# EasyEDA schematic SCH_RE2-YM2413-REV.0.5_2024-09-29.json

## Sheets
1 OPLL: TITLE: Sheet_1; REV: 1.0; Date: 2023-12-16; Sheet: 1/1; Drawn By: Denjhang; Company: Your Company
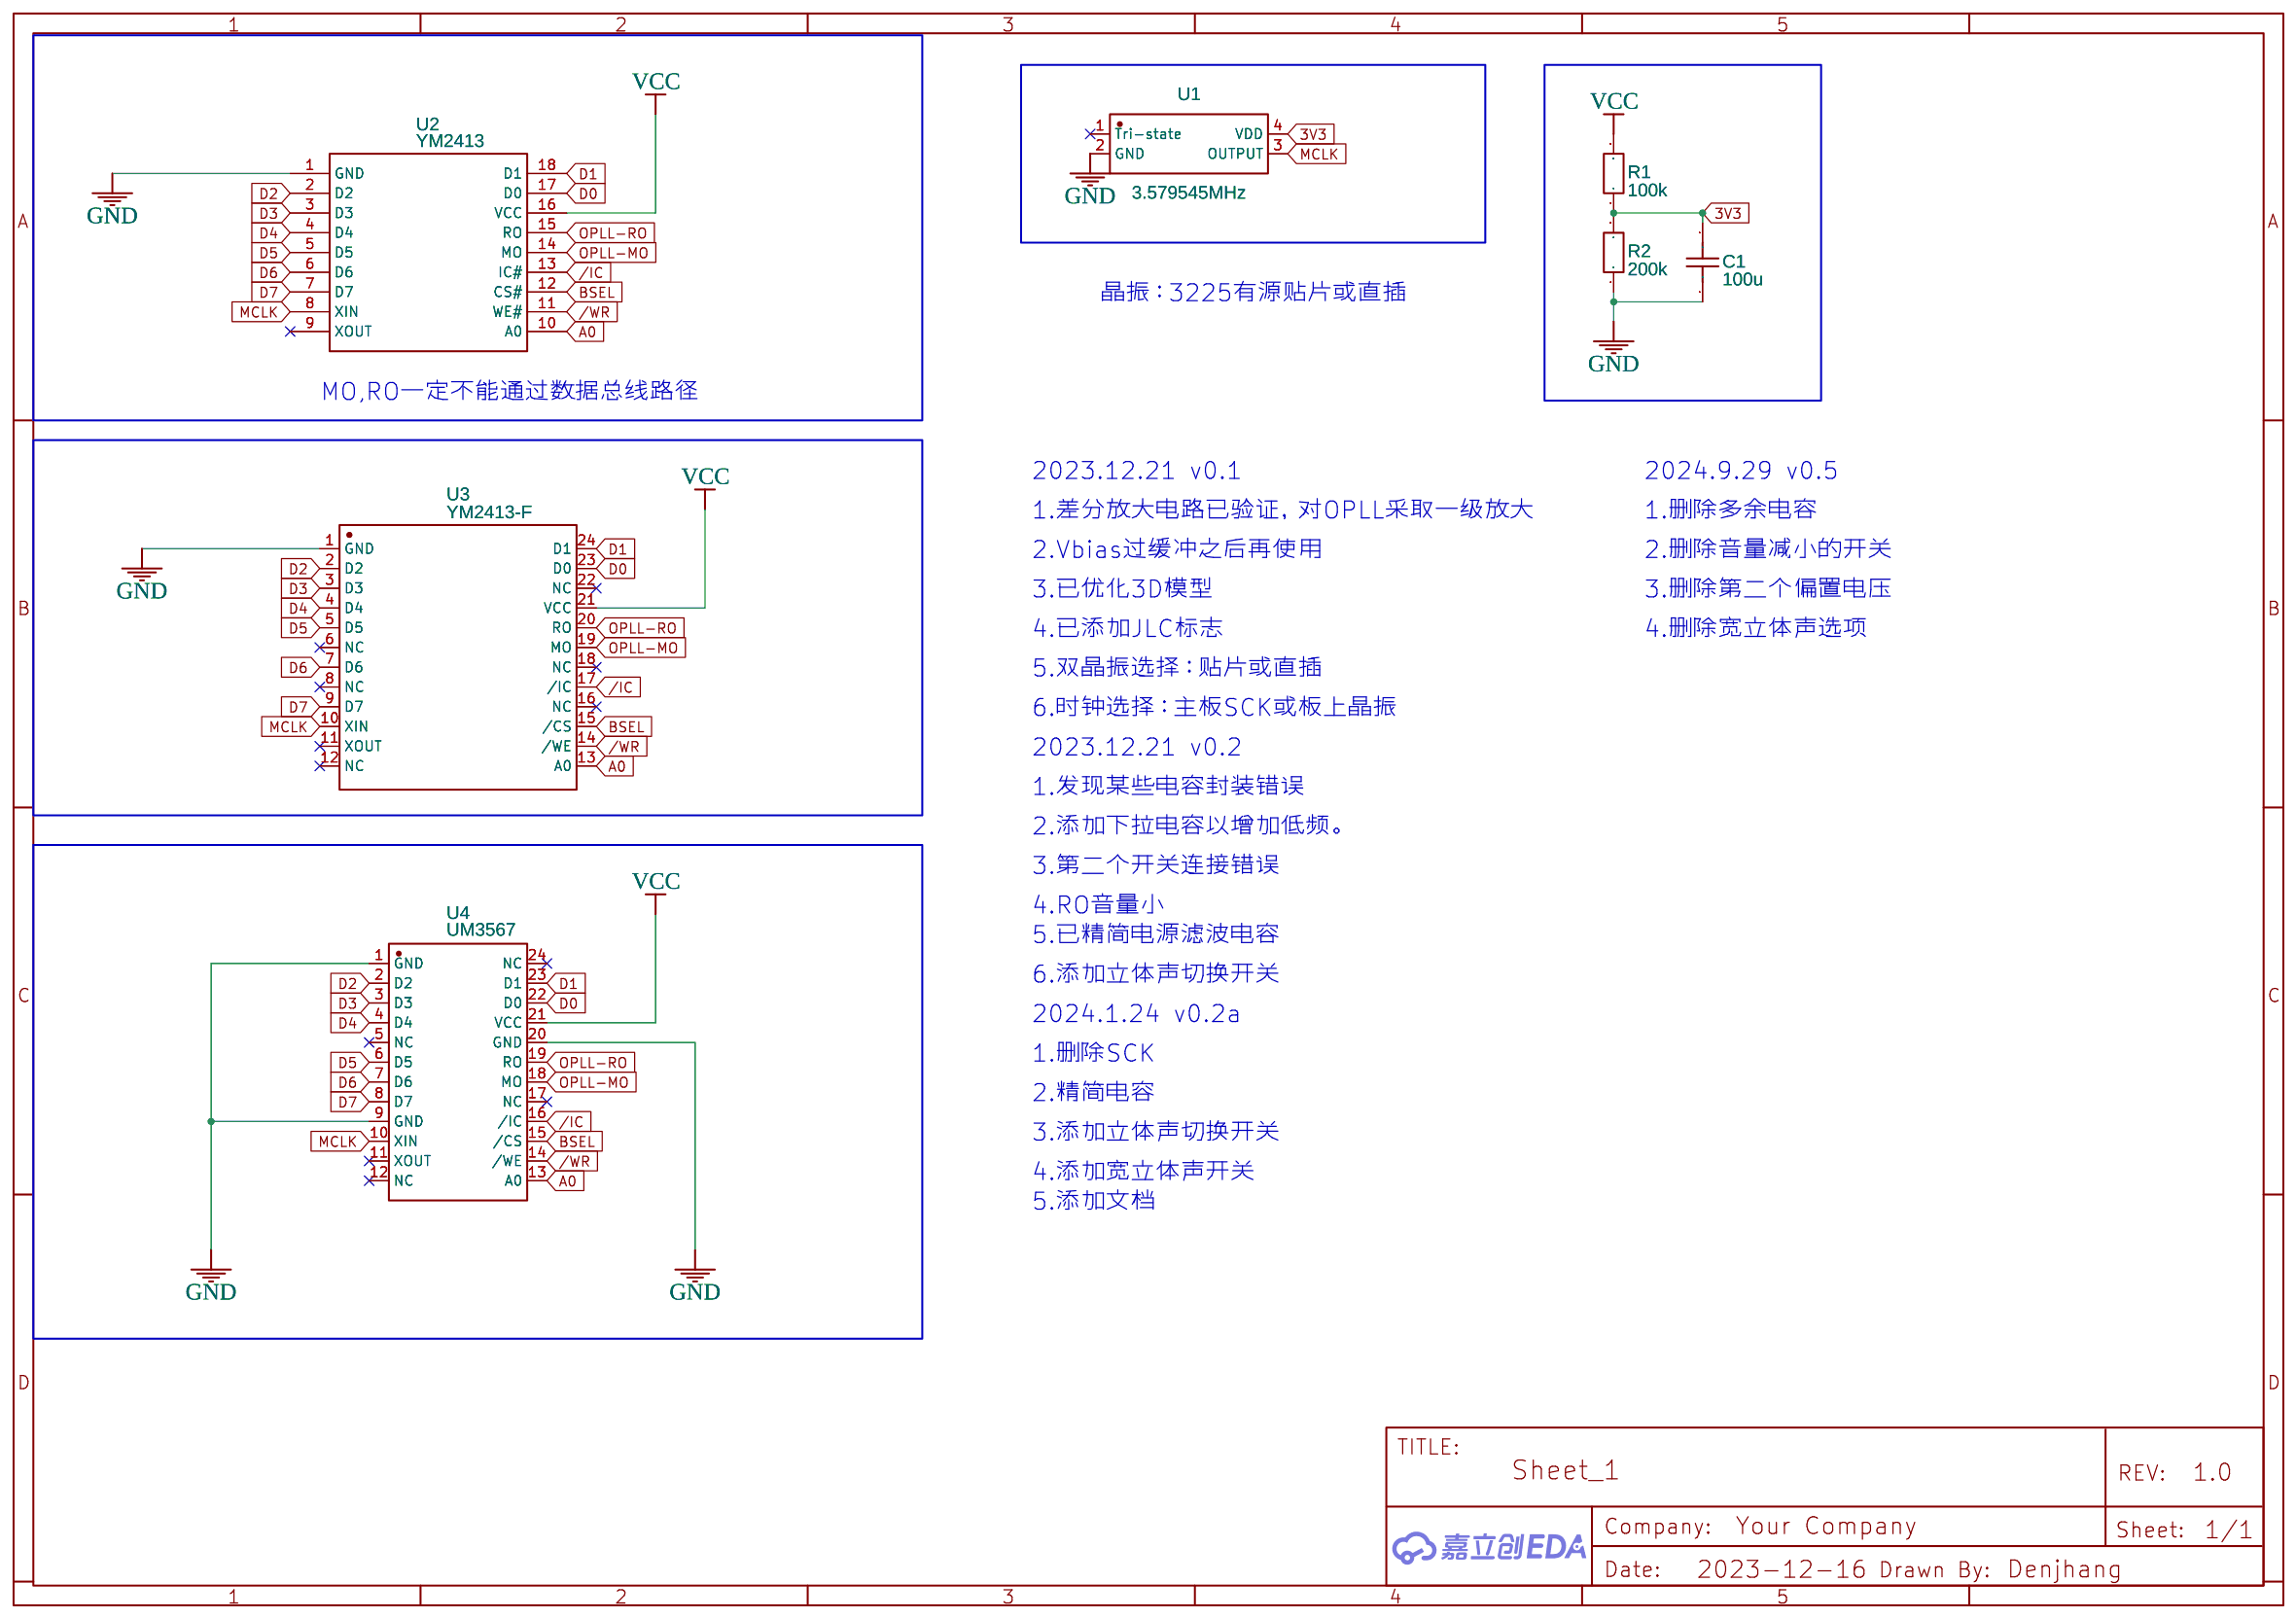
[diagram p0: OPLL]
2 BUS-PSU
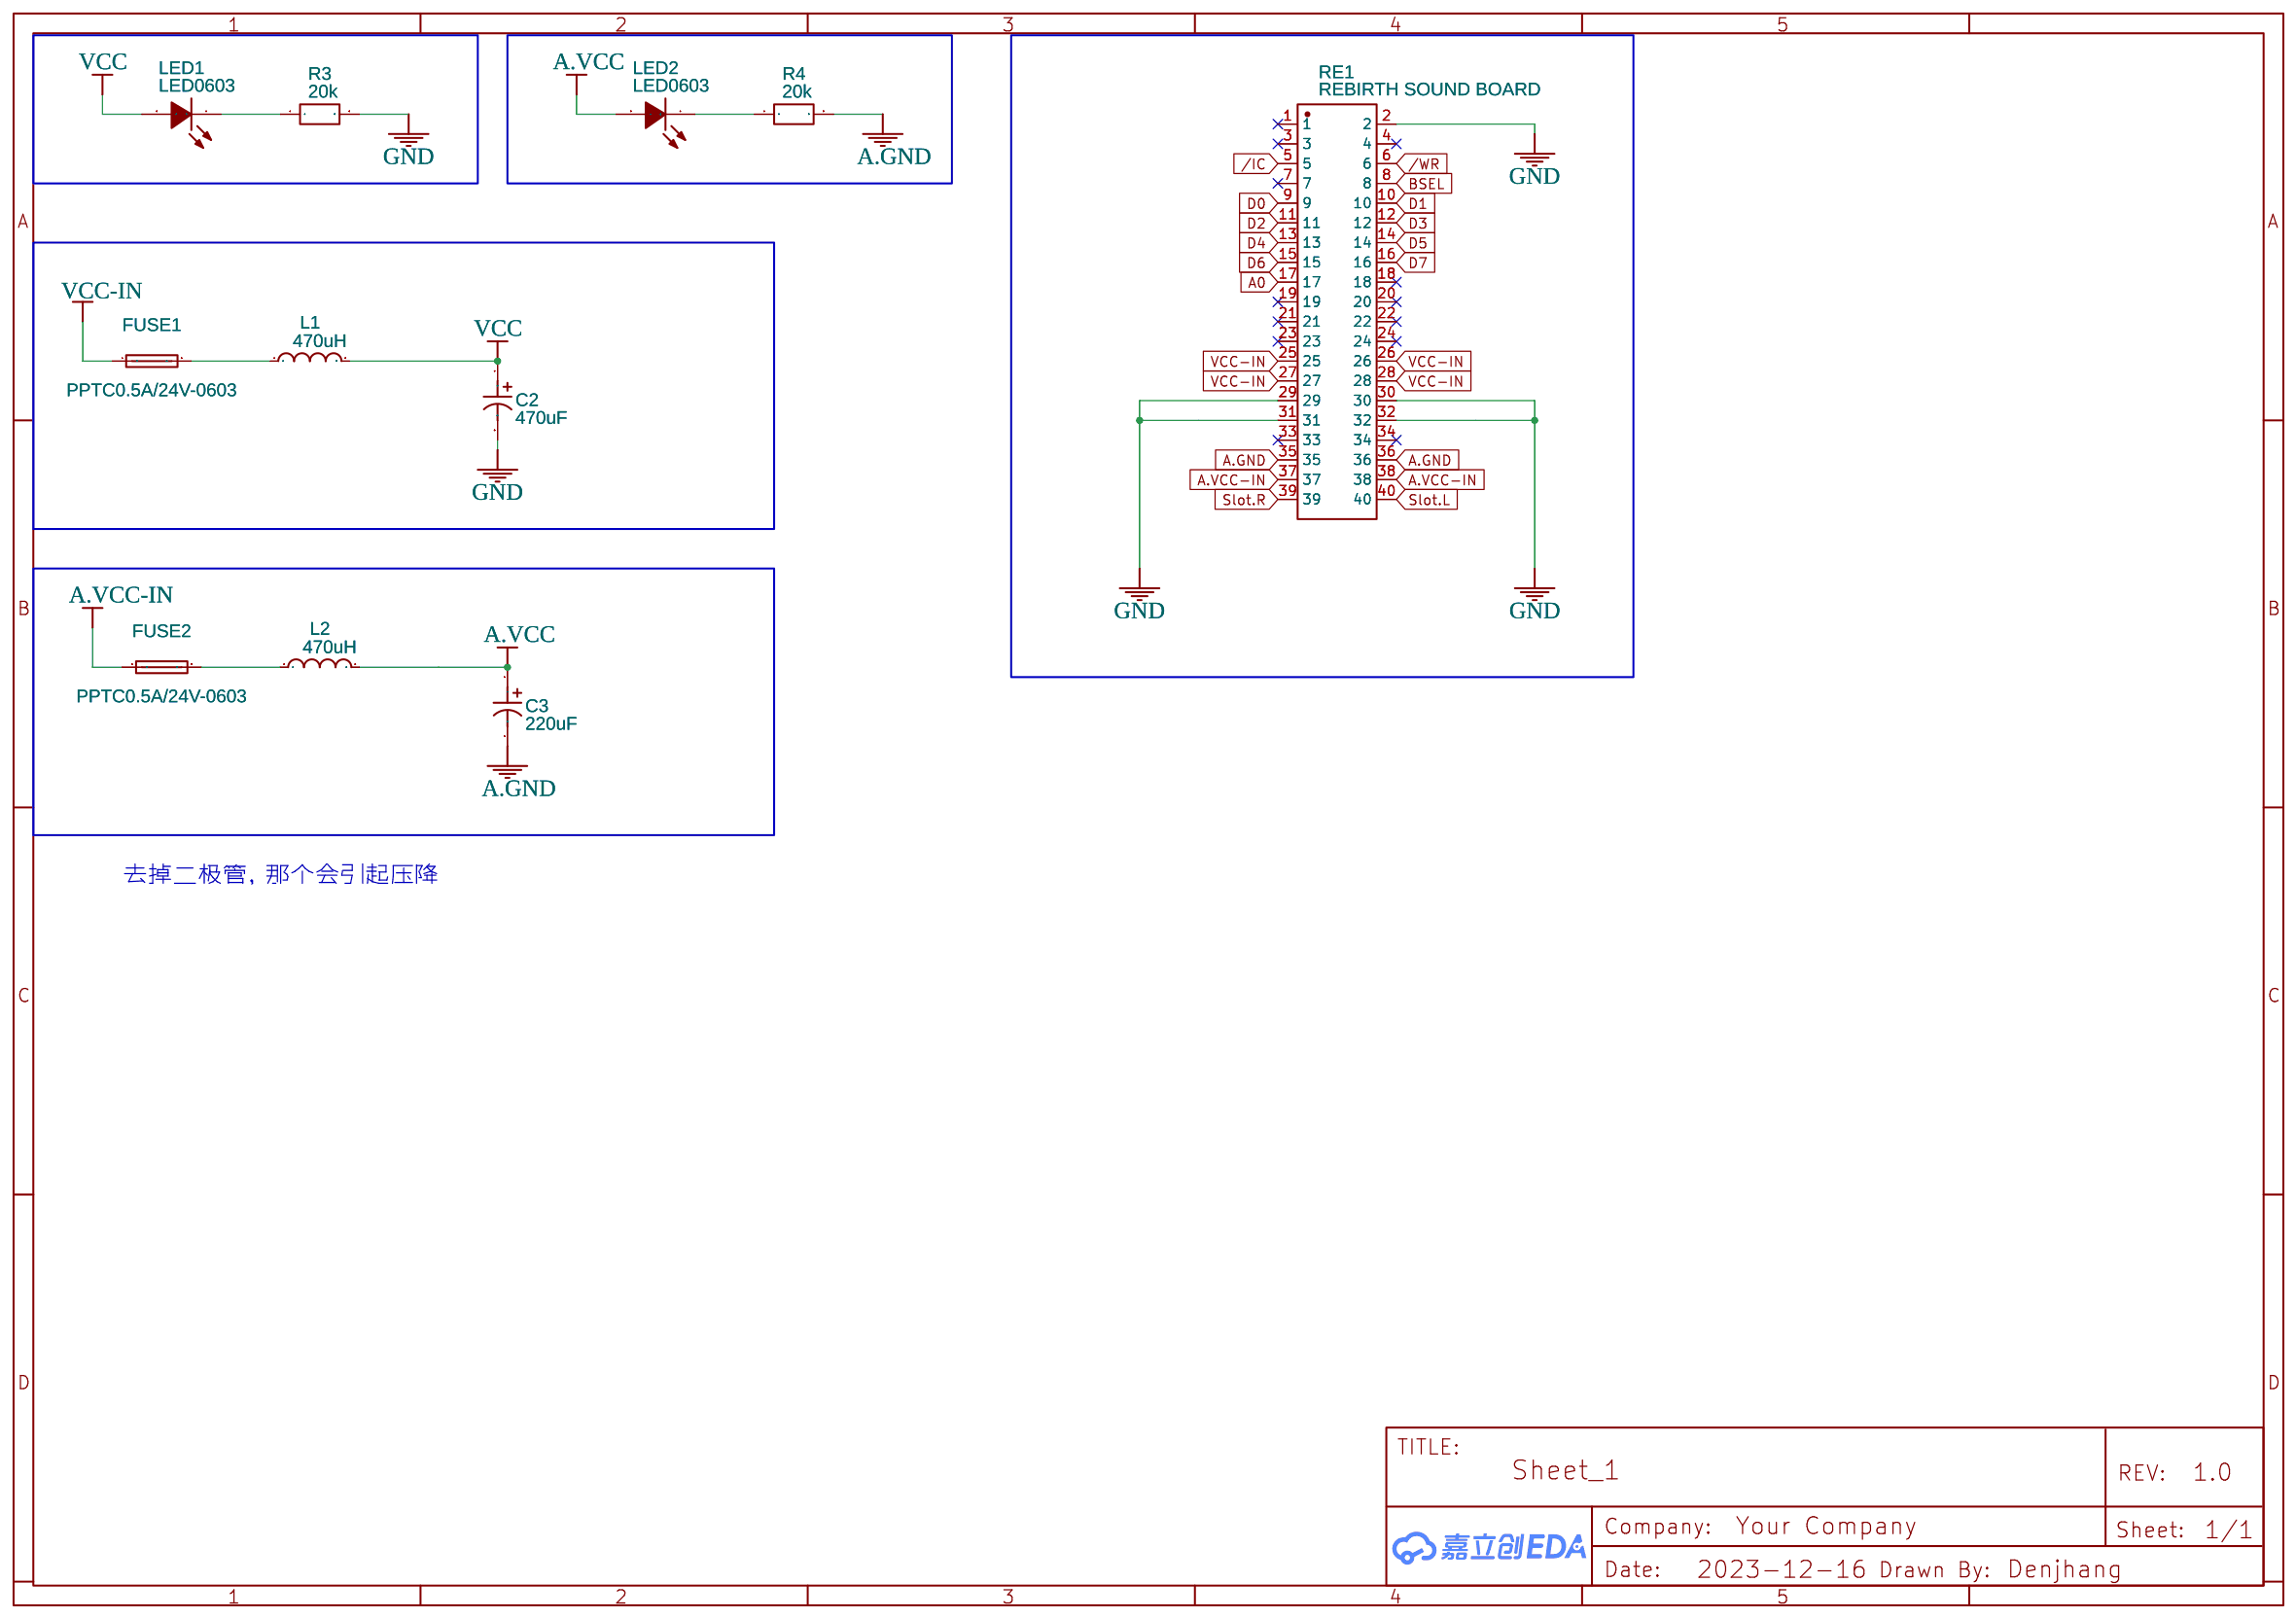
[diagram p1: BUS-PSU]
3 AMP1
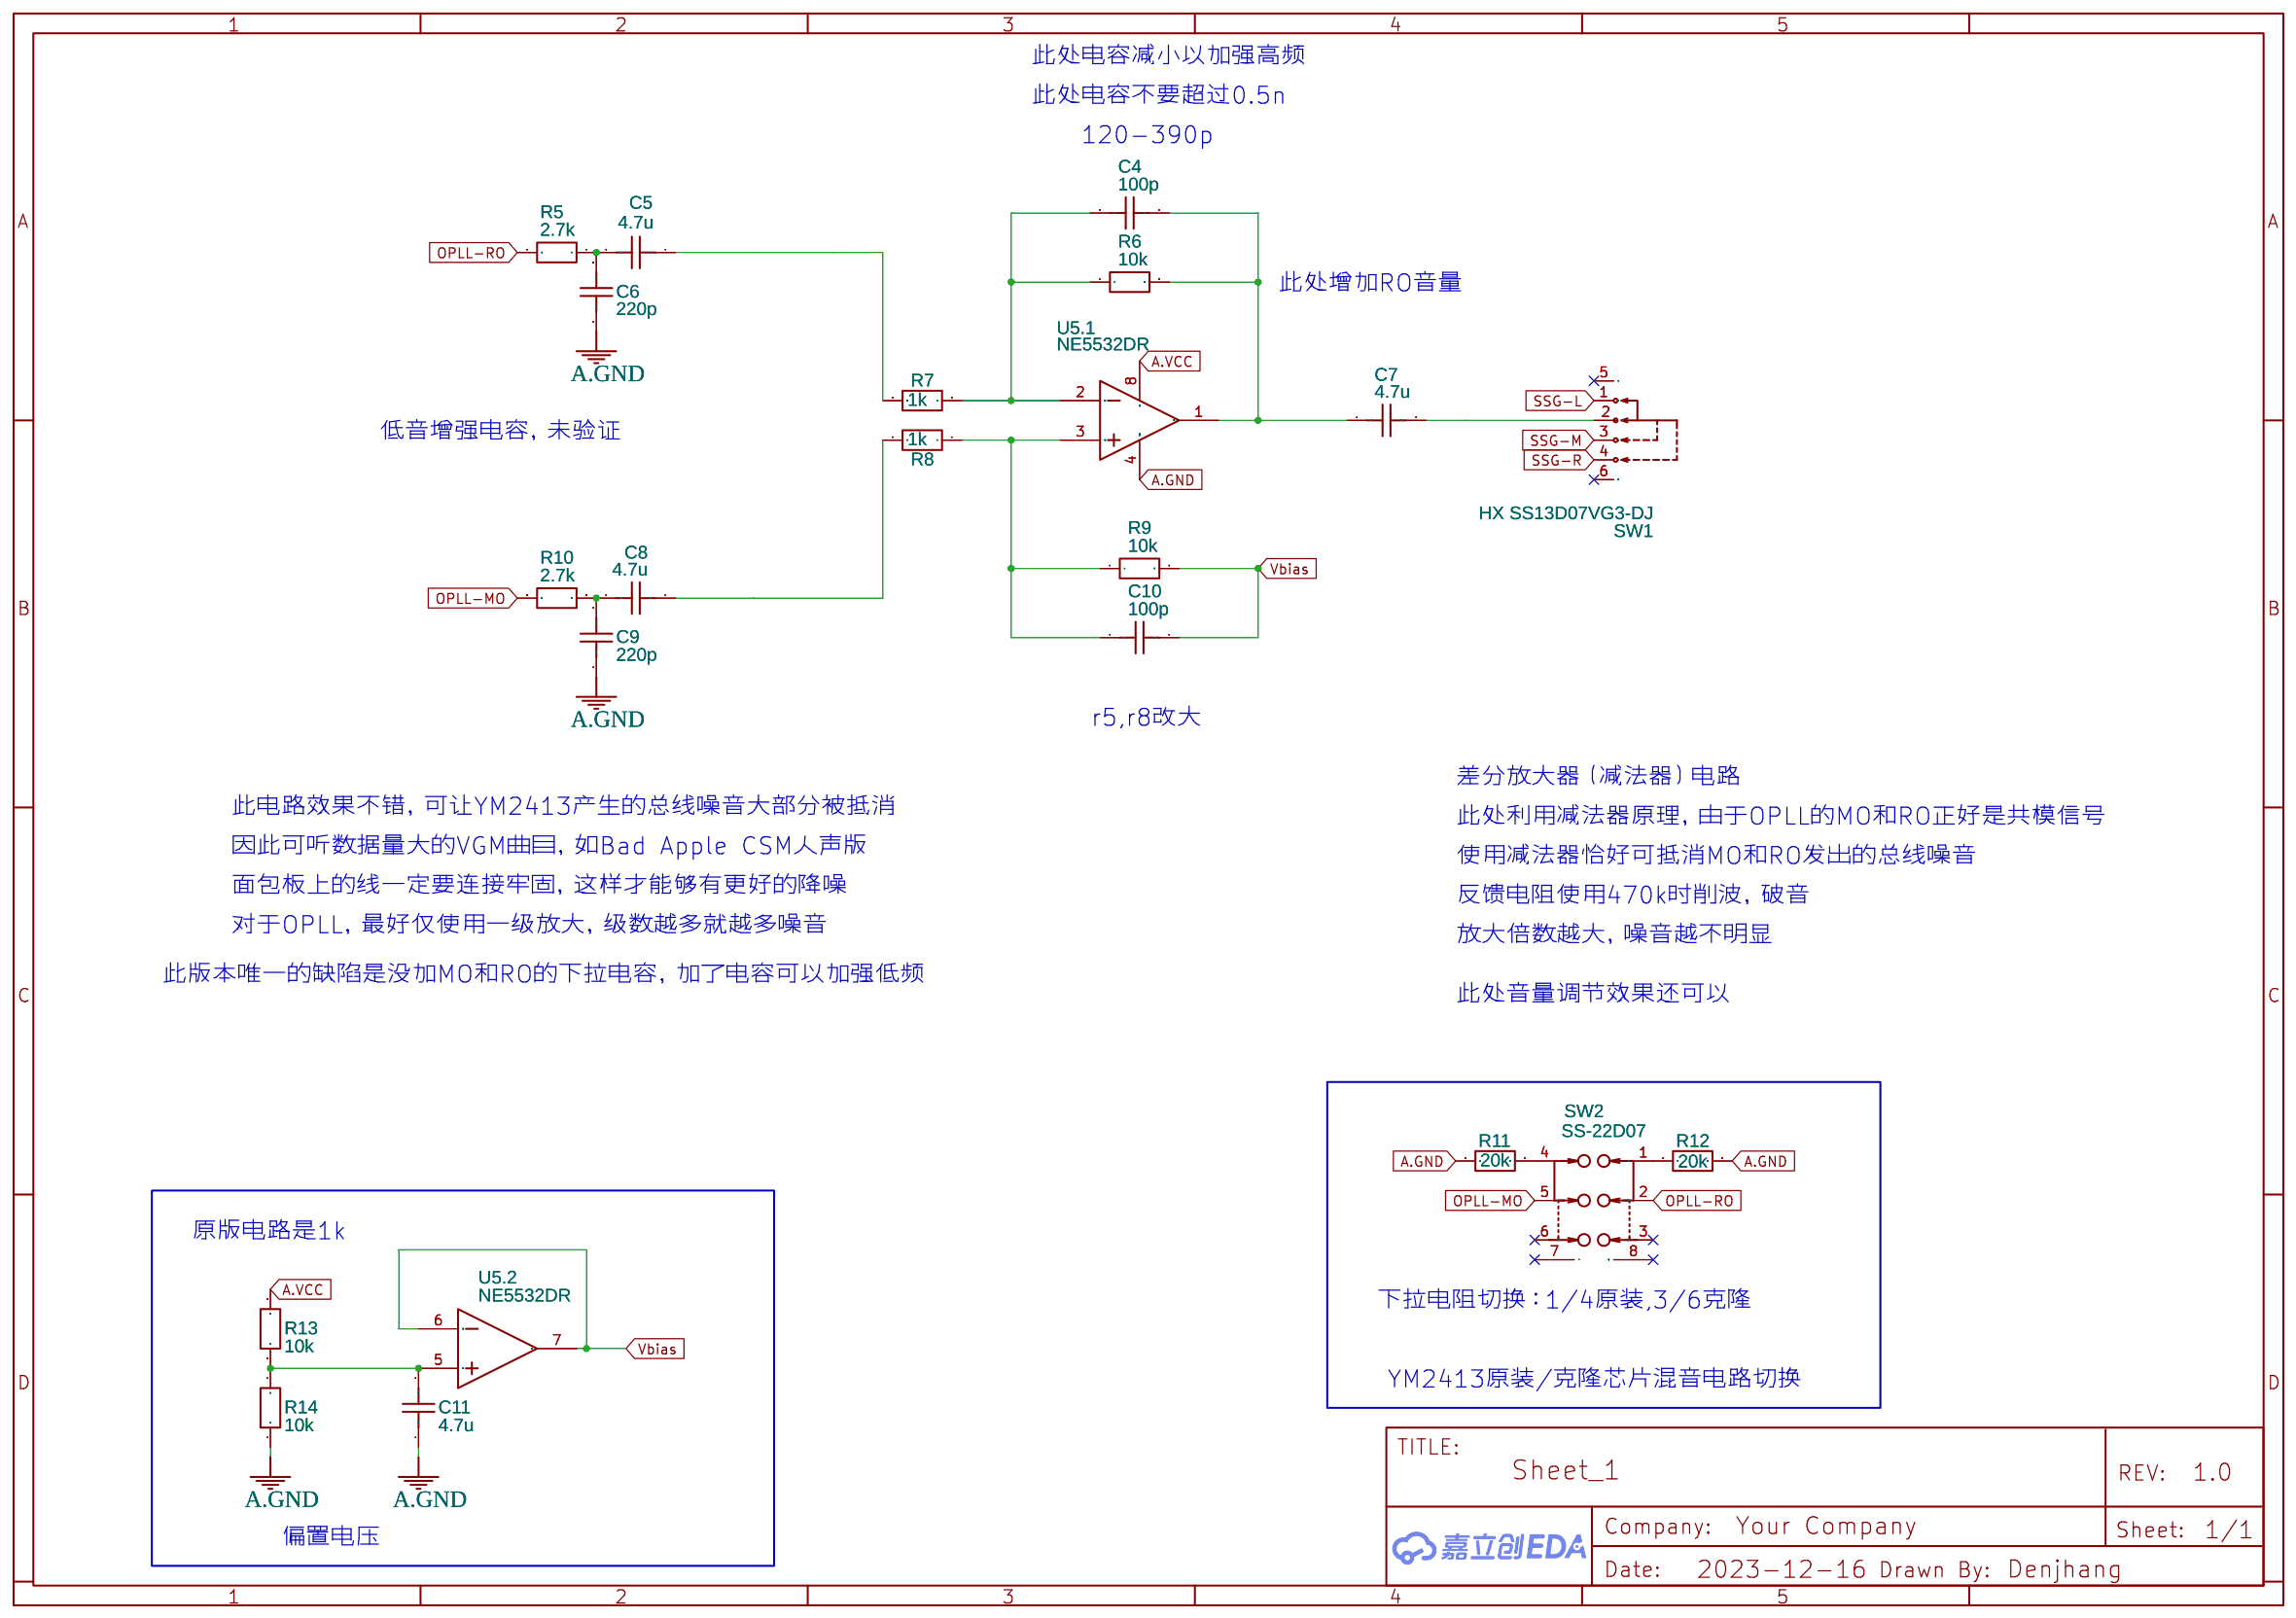
[diagram p2: AMP1]
4 Stereo: Date: 2024-01-24
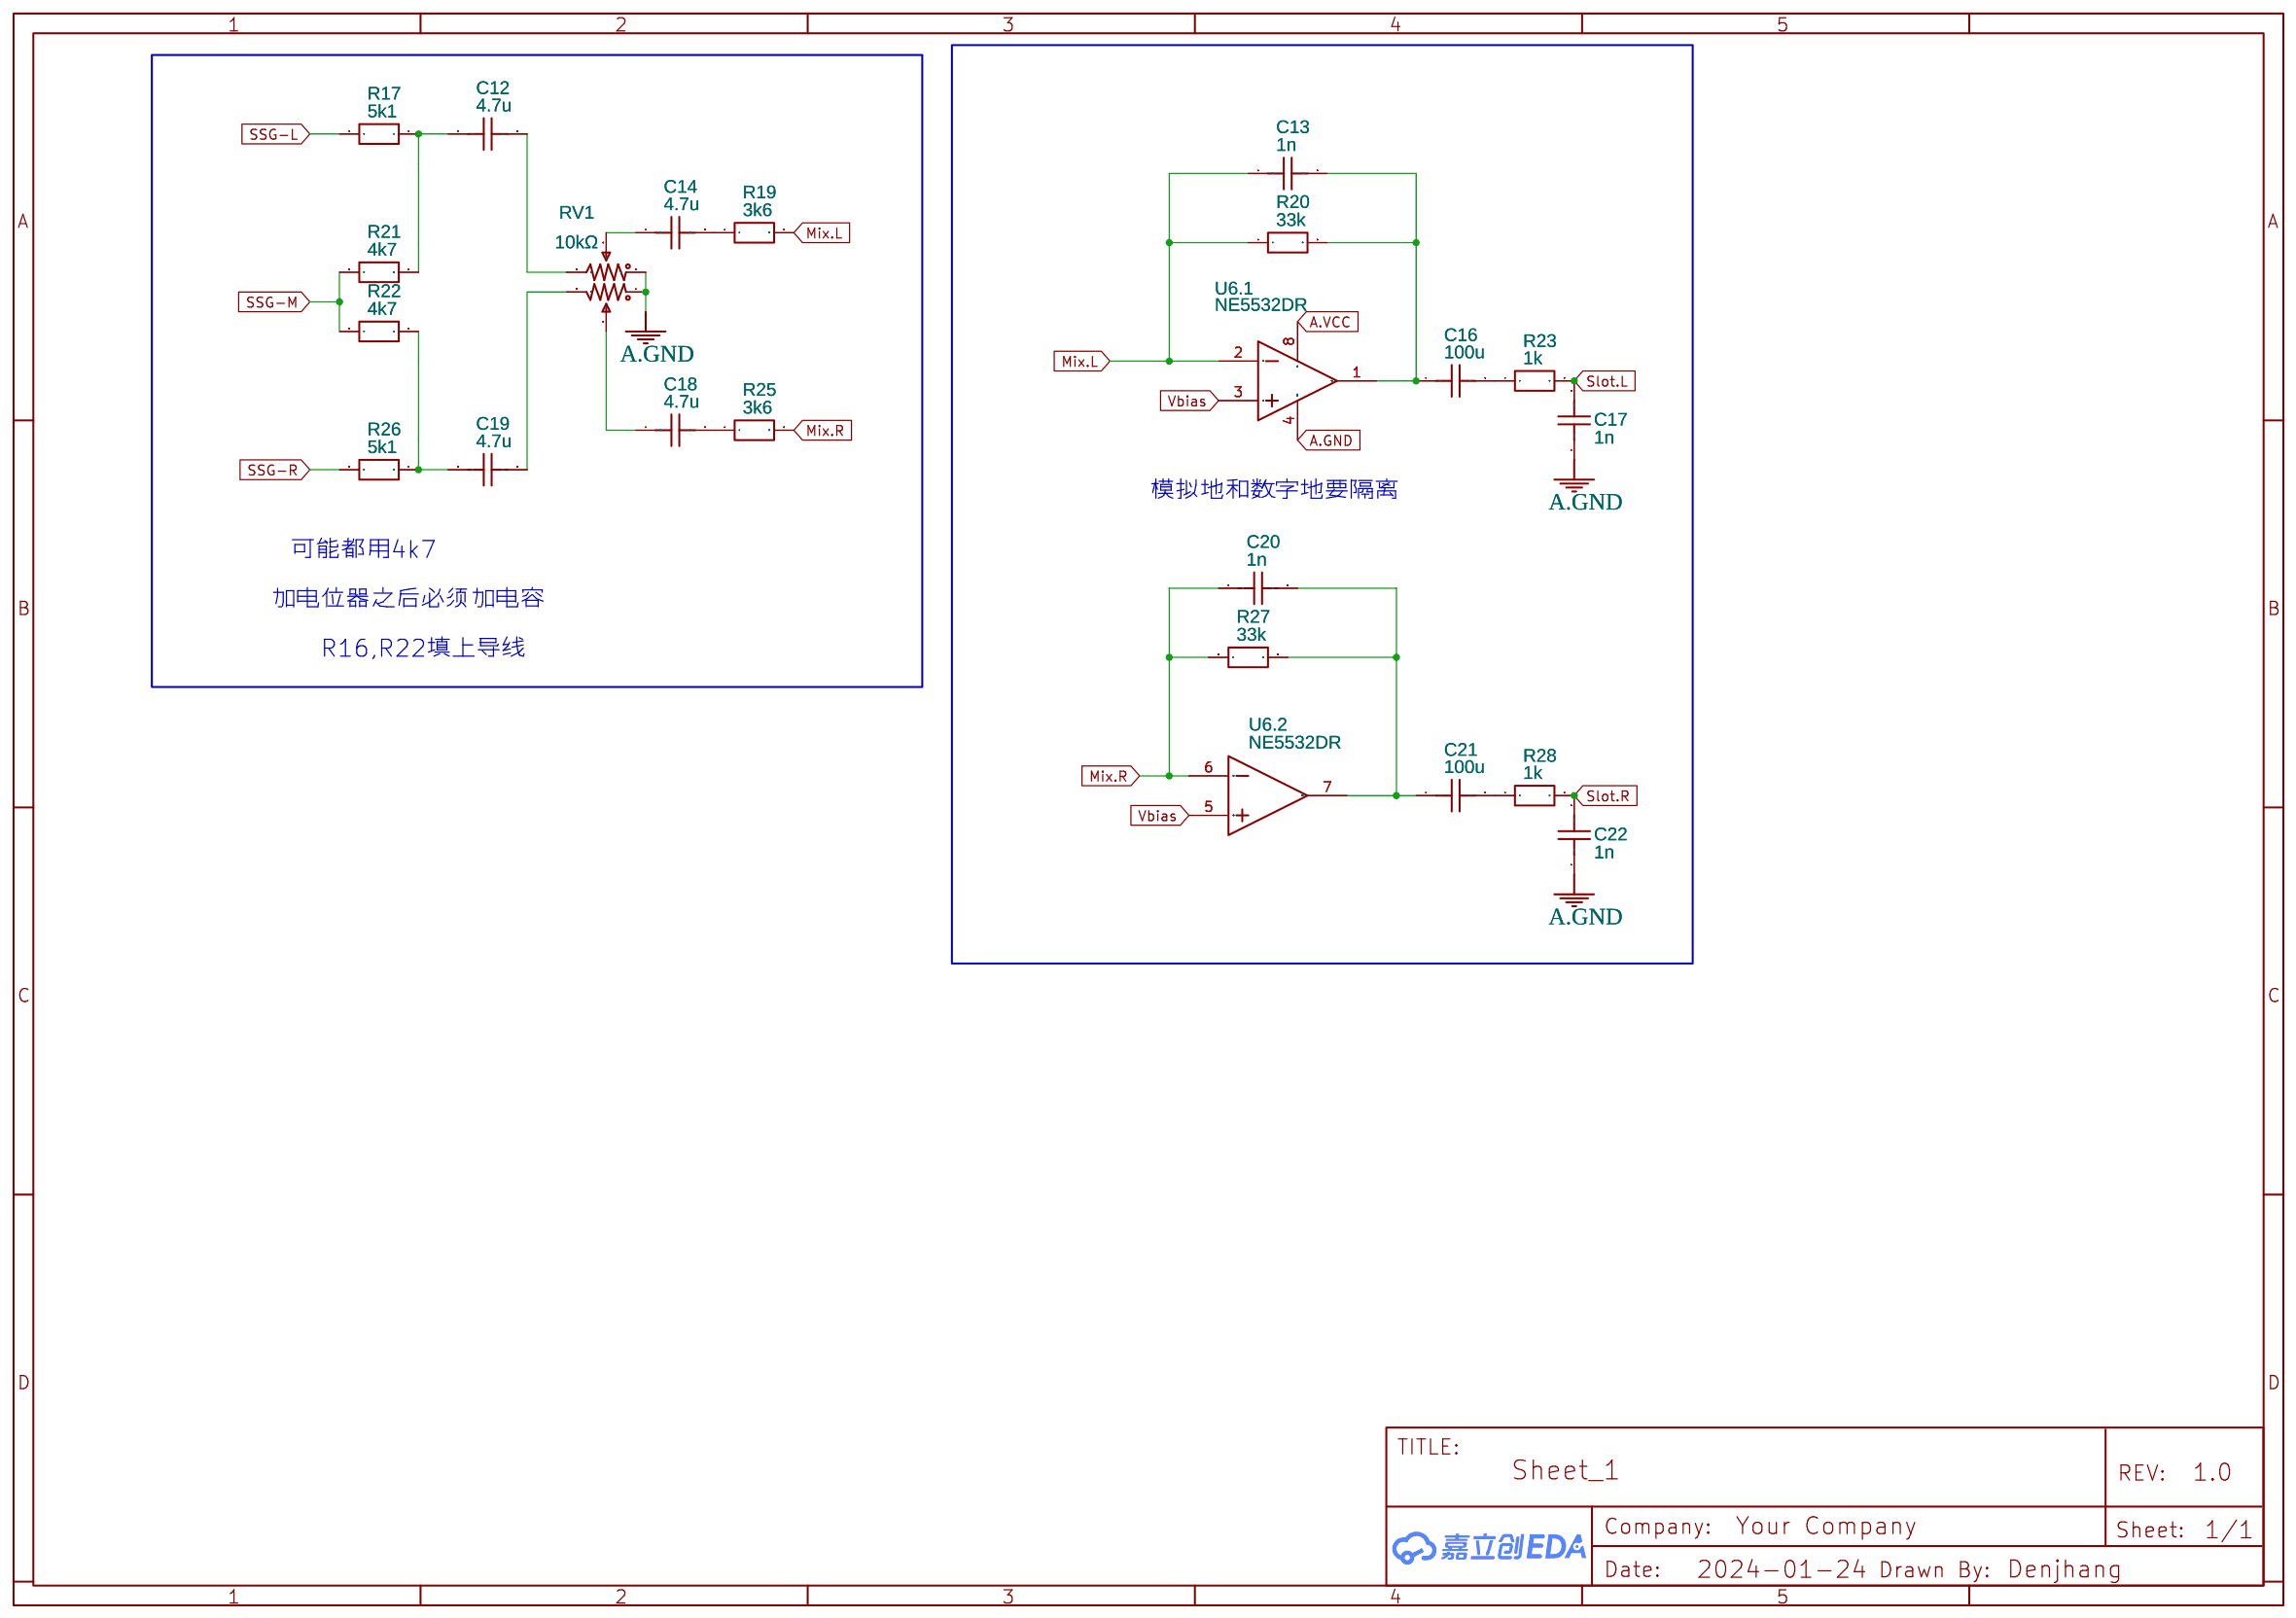
[diagram p3: Stereo]

## Parts
sheet AMP1
C4  100p  [C0603]
C5  4.7u  [C0603]
C6  220p  [C0603]
C7  4.7u  [C0603]
C8  4.7u  [C0603]
C9  220p  [C0603]
C10  100p  [C0603]
C11  4.7u  [C0603]
R5  2.7k  [R0603]
R6  10k  [R0603]
R7  1k  [R0603]
R8  1k  [R0603]
R9  10k  [R0603]
R10  2.7k  [R0603]
R11  20k  [R0603]
R12  20k  [R0603]
R13  10k  [R0603]
R14  10k  [R0603]
SW1  HX SS13D07VG3-DJ  [SW-TH_SS13D07VG4]
SW2  SS-22D07  [SW-TH_SS-22D07]
U5  NE5532DR  [SOIC-8_L4.9-W3.9-P1.27-LS6.0-BL]  (sections 1,2)
sheet BUS-PSU
C2  470uF  [CAP-SMD_BD6.3-L6.6-W6.6-FD]
C3  220uF  [CAP-SMD_BD6.3-L6.6-W6.6-LS7.2-FD]
FUSE1  PPTC0.5A/24V-0603  [F0603]
FUSE2  PPTC0.5A/24V-0603  [F0603]
L1  470uH  [IND-SMD_L5.8-W5.2]
L2  470uH  [IND-SMD_L5.8-W5.2]
LED1  LED0603  [LED0603-RD]
LED2  LED0603  [LED0603-RD]
R3  20k  [R0603]
R4  20k  [R0603]
RE1  REBIRTH SOUND BOARD  [REBIRTH SOUND BOARD]
sheet OPLL
C1  100u  [C1206]
R1  100k  [R0603]
R2  200k  [R0603]
U1  3.579545MHz  [OSC-SMD_4P-L3.2-W2.5-BL]
U2  YM2413  [DIP-18_方孔IC插座]
U3  YM2413-F  [SOIC24-YMF276]
U4  UM3567  [DIP-24_L31.0-W13.5-P2.54-LS15.2-BL]
sheet Stereo
C12  4.7u  [C0603]
C13  1n  [C0603]
C14  4.7u  [C0603]
C16  100u  [C1206]
C17  1n  [C0603]
C18  4.7u  [C0603]
C19  4.7u  [C0603]
C20  1n  [C0603]
C21  100u  [C1206]
C22  1n  [C0603]
R17  5k1  [R0603]
R19  3k6  [R0603]
R20  33k  [R0603]
R21  4k7  [R0603]
R22  4k7  [R0603]
R23  1k  [R0603]
R25  3k6  [R0603]
R26  5k1  [R0603]
R27  33k  [R0603]
R28  1k  [R0603]
RV1  10kΩ  [RK097G-DJ]
U6  NE5532DR  [SOIC-8_L4.9-W3.9-P1.27-LS6.0-BL]  (sections 1,2)

## Library data of the parts
C4-C14 C17-C20 C22 = C_0603_US: Contributor: LCEDA_Lib
R1-R14 R17 R19-R23 R25-R28 = R_0603_EU: Contributor: LCEDA_Lib
SW1 = HX SS13D07VG3-DJ: Supplier: LCSC; Supplier Part: C5149830; Manufacturer: hanxia(韩下); Manufacturer Part: HX SS13D07VG3; link: https://atta.szlcsc.com/upload/public/pdf/source/20220907/D3055C4464BFAA66BEB4549CABC5DD1D.pdf; Contributor: Denjhang
SW2 = SS-22D07: Supplier Part: C34982; Supplier: LCSC; Manufacturer: ReliaPro; JLCPCB Part Class: Extended Part; link: https://so.szlcsc.com/global.html?k=C34982&ref=editor
U5 U6 = NE5532DR: image: //image.lceda.cn/szlcsc/C7426.jpg; SMT Type: Basic; subpart_no: 2; Supplier: LCSC; Manufacturer: TI(德州仪器); LCSC Assembly: Yes; Supplier Part: C7426; JLCPCB Part Class: Basic Part
C2 = RVT220UF16V67RV0015: Contributor: LCSC; Supplier: LCSC; Supplier Part: C2887273; Manufacturer: KNSCHA(科尼盛); JLCPCB Part Class: Extended Part; link: https://so.szlcsc.com/global.html?k=C2887273&ref=editor
C3 = RVT47UF35V67RV0039: Contributor: LCSC; Supplier: LCSC; Supplier Part: C2836440; Manufacturer: KNSCHA(科尼盛); JLCPCB Part Class: Extended Part; link: https://so.szlcsc.com/global.html?k=C2836440&ref=editor
FUSE1 FUSE2 = PPTC0.5A/24V-0603: Contributor: LCSC; Supplier: LCSC; Supplier Part: C9900007586; Manufacturer: null; Manufacturer Part: PPTC0.5A/24V 自恢复保险丝-0603; JLCPCB Part Class: Extended Part
L1 L2 = MSCD54-471KT: Contributor: LCSC; Supplier: LCSC; Supplier Part: C915206; Manufacturer: Meled(美莱); JLCPCB Part Class: Extended Part; link: https://so.szlcsc.com/global.html?k=C915206&ref=editor
LED1 LED2 = LED0603: Supplier: LCSC; Supplier Part: C2892154; Manufacturer: GBG; Manufacturer Part: GBG-C192KRKT; link: https://atta.szlcsc.comnull; Contributor: Denjhang
RE1 = REBIRTH SOUND BOARD: Contributor: lcsc; Supplier: LCSC; Supplier Part: C5242133; Manufacturer: XKB Connectivity(中国星坤); Manufacturer Part: X6522WR-2x20H-C60D30-E43F03
C1 C16 C21 = C_1206_US: Contributor: LCEDA_Lib
U1 = OT32254MJBA4SL: Contributor: lcsc; Supplier: LCSC; Supplier Part: C2831397; Manufacturer: YXC(扬兴晶振); JLCPCB Part Class: Extended Part; link: https://so.szlcsc.com/global.html?k=C2831397&ref=editor
U2 = YM2413: Contributor: denjhang
U3 = YM2413-F: Contributor: Denjhang
U4 = UM3567: Contributor: Denjhang
RV1 = RK097-双连体: Contributor: LCSC; Supplier: LCSC; Supplier Part: C231763; Manufacturer: ALPSALPINE(阿尔卑斯阿尔派); Manufacturer Part: RK09712200MY; JLCPCB Part Class: Extended Part

## Nets
3V3: C1.2 R1.1 R2.2 U1.4(VDD)
GND: C1.1 C2.2 R2.1 R3.2 RE1.2 RE1.29 RE1.30 RE1.31 RE1.32 U1.2(GND) U2.1(GND) U3.1(GND) U4.1(GND) U4.9(GND) U4.20(GND)
VCC: C2.1 L1.2 LED1.2(A) R1.2 U2.16(VCC) U3.21(VCC) U4.21(VCC)
VCC-IN: FUSE1.1 RE1.25 RE1.26 RE1.27 RE1.28
/IC: RE1.5 U2.13(IC#) U3.17(/IC) U4.16(/IC)
/WR: RE1.6 U2.11(WE#) U3.14(/WE) U4.14(/WE)
A0: RE1.17 U2.10(A0) U3.13(A0) U4.13(A0)
A.GND: C3.2 C6.1 C9.1 C11.1 C17.1 C22.1 R4.2 R11.1 R12.2 R14.1 RE1.35 RE1.36 RV1.1 RV1.4 U5.4(VCC-/GND) U6.4(VCC-/GND)
A.VCC: C3.1 L2.2 LED2.2(A) R13.2 U5.8(VCC+) U6.8(VCC+)
A.VCC-IN: FUSE2.1 RE1.37 RE1.38
BSEL: RE1.8 U2.12(CS#) U3.15(/CS) U4.15(/CS)
D0: RE1.9 U2.17(D0) U3.23(D0) U4.22(D0)
D1: RE1.10 U2.18(D1) U3.24(D1) U4.23(D1)
D2: RE1.11 U2.2(D2) U3.2(D2) U4.2(D2)
D3: RE1.12 U2.3(D3) U3.3(D3) U4.3(D3)
D4: RE1.13 U2.4(D4) U3.4(D4) U4.4(D4)
D5: RE1.14 U2.5(D5) U3.5(D5) U4.6(D5)
D6: RE1.15 U2.6(D6) U3.7(D6) U4.7(D6)
D7: RE1.16 U2.7(D7) U3.9(D7) U4.8(D7)
MCLK: U1.3(OUTPUT) U2.8(XIN) U3.10(XIN) U4.10(XIN)
Mix.L: C13.1 R19.2 R20.1 U6.2(IN1-)
Mix.R: C20.1 R25.2 R27.1 U6.6(IN2-)
OPLL-MO: R10.2 SW2.5 U2.14(MO) U3.19(MO) U4.18(MO)
OPLL-RO: R5.2 SW2.2 U2.15(RO) U3.20(RO) U4.19(RO)
Slot.L: C17.2 R23.2 RE1.40
Slot.R: C22.2 R28.2 RE1.39
SSG-L: R17.2 SW1.1
SSG-M: R21.2 R22.2 SW1.3
SSG-R: R26.2 SW1.4
Vbias: C10.2 R9.2 U5.6(IN2-) U5.7(OUT2) U6.3(IN1+) U6.5(IN2+)
Net-(C4-1): C4.1 R6.1 R7.1 U5.2(IN1-)
Net-(C4-2): C4.2 C7.1 R6.2 U5.1(OUT1)
Net-(C5-1): C5.1 R7.2
Net-(C5-2): C5.2 C6.2 R5.1
Net-(C7-2): C7.2 SW1.2
Net-(C8-1): C8.1 R8.2
Net-(C8-2): C8.2 C9.2 R10.1
Net-(C10-1): C10.1 R8.1 R9.1 U5.3(IN1+)
Net-(C11-2): C11.2 R13.1 R14.2 U5.5(IN2+)
Net-(C12-1): C12.1 R17.1 R21.1
Net-(C12-2): C12.2 RV1.3
Net-(C13-2): C13.2 C16.1 R20.2 U6.1(OUT1)
Net-(C14-1): C14.1 RV1.2
Net-(C14-2): C14.2 R19.1
Net-(C16-2): C16.2 R23.1
Net-(C18-1): C18.1 RV1.5
Net-(C18-2): C18.2 R25.1
Net-(C19-1): C19.1 R22.1 R26.1
Net-(C19-2): C19.2 RV1.6
Net-(C20-2): C20.2 C21.1 R27.2 U6.7(OUT2)
Net-(C21-2): C21.2 R28.1
Net-(FUSE1-2): FUSE1.2 L1.1
Net-(FUSE2-2): FUSE2.2 L2.1
Net-(LED1-1): LED1.1(C) R3.1
Net-(LED2-1): LED2.1(C) R4.1
Net-(R11-2): R11.2 SW2.4
Net-(R12-1): R12.1 SW2.1

Not connected (* = marked no-connect by the designer): RE1 1* 3* 4* 7* 18* 19* 20* 21* 22* 23* 24* 33* 34*; SW1 5* 6*; SW2 3* 6* 7* 8*; U1 1(Tri-state)*; U2 9(XOUT)*; U3 6(NC)* 8(NC)* 11(XOUT)* 12(NC)* 16(NC)* 18(NC)* 22(NC)*; U4 5(NC)* 11(XOUT)* 12(NC)* 17(NC)* 24(NC)*

## Notes on the sheets
sheet 1
- 晶振：3225有源贴片或直插
- MO,RO一定不能通过数据总线路径
- 2023.12.21 v0.1
- 2024.9.29 v0.5
- 1.差分放大电路已验证，对OPLL采取一级放大
- 1.删除多余电容
- 2.Vbias过缓冲之后再使用
- 2.删除音量减小的开关
- 3.已优化3D模型
- 3.删除第二个偏置电压
- 4.已添加JLC标志
- 4.删除宽立体声选项
- 5.双晶振选择：贴片或直插
- 6.时钟选择：主板SCK或板上晶振
- 2023.12.21 v0.2
- 1.发现某些电容封装错误
- 2.添加下拉电容以增加低频。
- 3.第二个开关连接错误
- 4.RO音量小
- 5.已精简电源滤波电容
- 6.添加立体声切换开关
- 2024.1.24 v0.2a
- 1.删除SCK
- 2.精简电容
- 3.添加立体声切换开关
- 4.添加宽立体声开关
- 5.添加文档
sheet 2
- 去掉二极管，那个会引起压降
sheet 3
- 此处电容减小以加强高频
- 此处电容不要超过0.5n
- 120-390p
- 此处增加RO音量
- 低音增强电容，未验证
- r5,r8改大
- 差分放大器（减法器）电路
- 此电路效果不错，可让YM2413产生的总线噪音大部分被抵消
- 此处利用减法器原理，由于OPLL的MO和RO正好是共模信号
- 因此可听数据量大的VGM曲目，如Bad Apple CSM人声版
- 使用减法器恰好可抵消MO和RO发出的总线噪音
- 面包板上的线一定要连接牢固，这样才能够有更好的降噪
- 反馈电阻使用470k时削波，破音
- 对于OPLL，最好仅使用一级放大，级数越多就越多噪音
- 放大倍数越大，噪音越不明显
- 此版本唯一的缺陷是没加MO和RO的下拉电容，加了电容可以加强低频
- 此处音量调节效果还可以
- 原版电路是1k
- 下拉电阻切换：1/4原装,3/6克隆
- YM2413原装/克隆芯片混音电路切换
- 偏置电压
sheet 4
- 模拟地和数字地要隔离
- 可能都用4k7
- 加电位器之后必须加电容
- R16,R22填上导线
